# Altium schematic sheet MCU_STM32L011.SchDoc: MCU_STM32L011
size A4; DrawnBy: BossFish; Revision: Test/v0.2; SheetNumber: 3; SheetTotal: 4
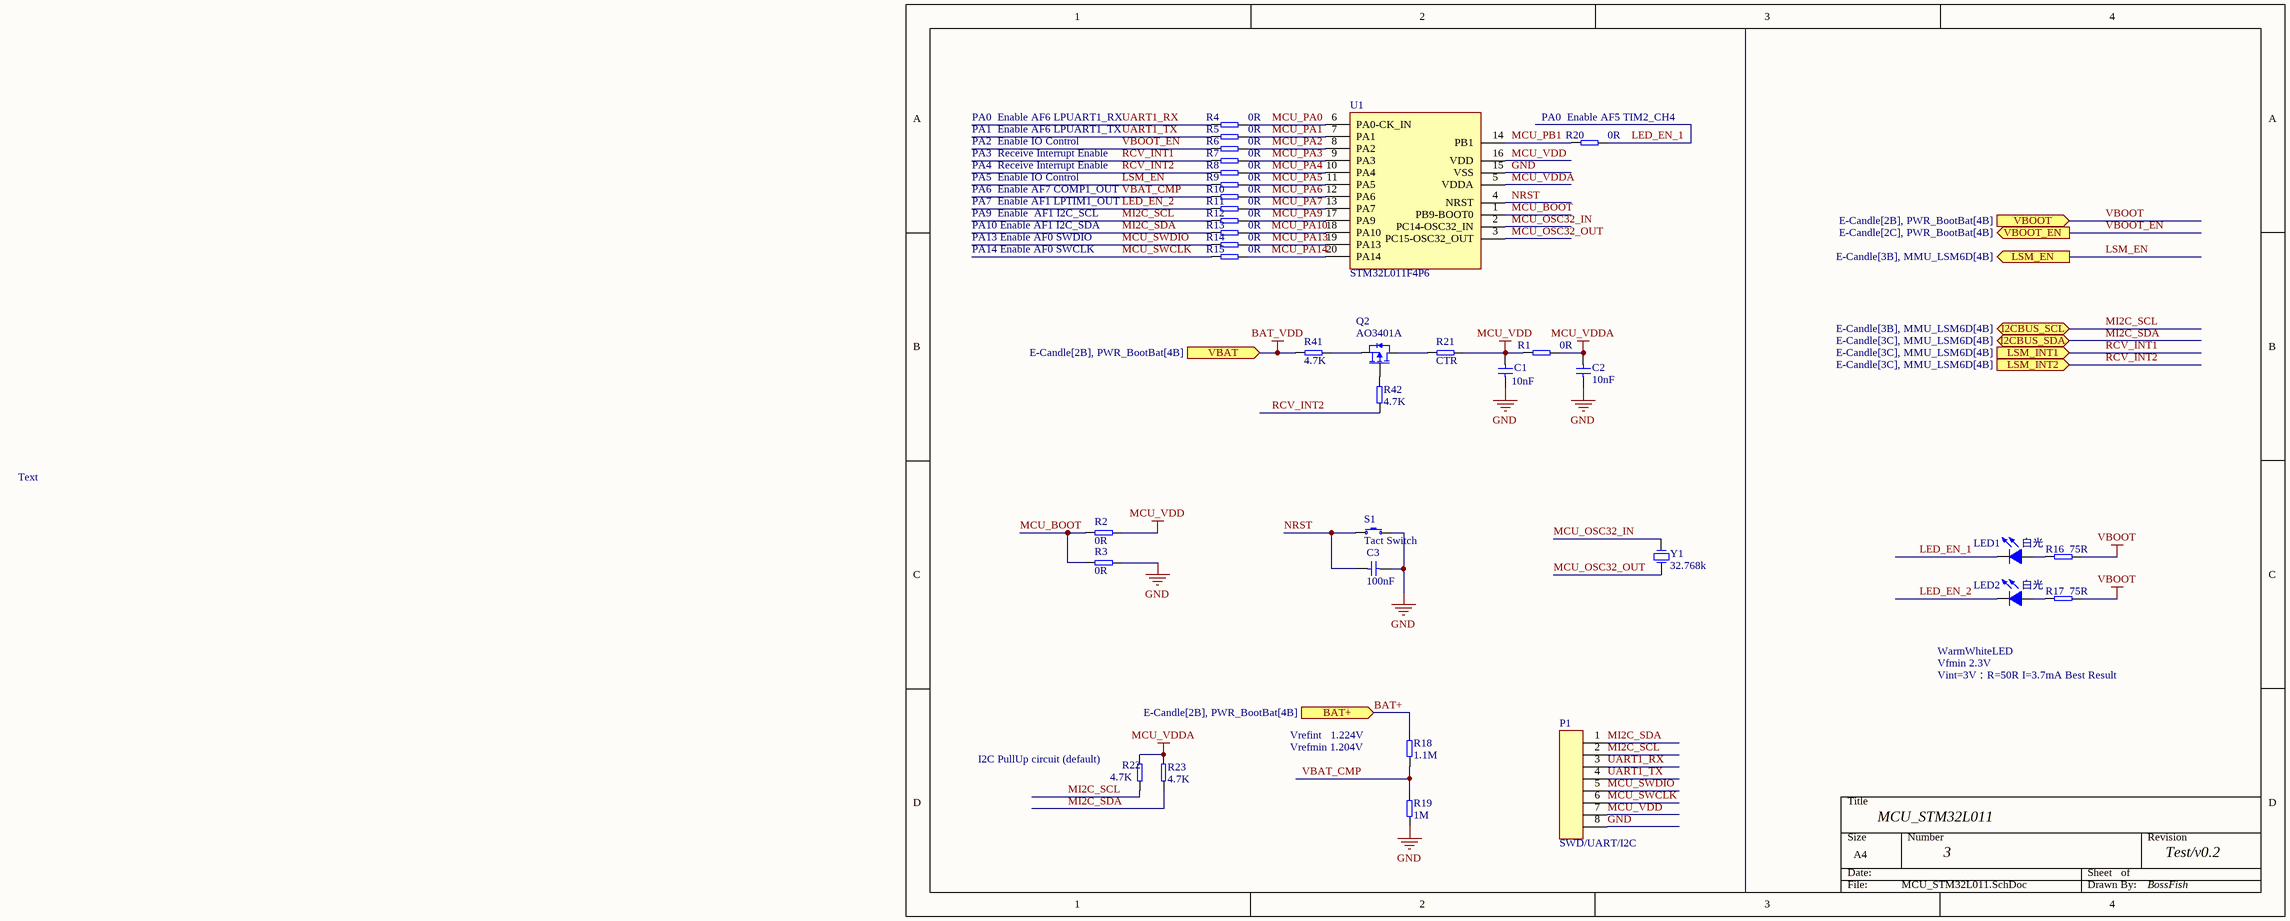
[diagram p0: MCU_STM32L011.SchDoc]

## Parts
C1  10nF  [0603-C]
C2  10nF  [0603-C]
C3  100nF  [0603-C]
LED1  白光  [0805-LED]
LED2  白光  [0805-LED]
P1  SWD/UART/I2C  [2.54mm 1x8P]
Q2  AO3401A  [SOT-23-3]
R1  0R  [0603-R]
R2  0R  [0603-R]
R3  0R  [0603-R]
R4  0R  [0603-R]
R5  0R  [0603-R]
R6  0R  [0603-R]
R7  0R  [0603-R]
R8  0R  [0603-R]
R9  0R  [0603-R]
R10  0R  [0603-R]
R11  0R  [0603-R]
R12  0R  [0603-R]
R13  0R  [0603-R]
R14  0R  [0603-R]
R15  0R  [0603-R]
R16  75R  [0603-R]
R17  75R  [0603-R]
R18  1.1M  [0603-R]
R19  1M  [0603-R]
R20  0R  [0603-R]
R21  CTR  [0603-R]
R22  4.7K  [0603-R]
R23  4.7K  [0603-R]
R41  4.7K  [0603-R]
R42  4.7K  [0603-R]
S1  Tact Switch  [TS-3025]
U1  STM32L011F4P6  [TSSOP-20]
Y1  32.768k  [SMD3215-2P]

## Ports
BAT+ (in, see E-Candle[2B], PWR_BootBat[4B]), I2CBUS_SCL (bidir, see E-Candle[3B], MMU_LSM6D[4B]), I2CBUS_SDA (bidir, see E-Candle[3C], MMU_LSM6D[4B]), LSM_EN (out, see E-Candle[3B], MMU_LSM6D[4B]), LSM_INT1 (in, see E-Candle[3C], MMU_LSM6D[4B]), LSM_INT2 (in, see E-Candle[3C], MMU_LSM6D[4B]), VBAT (in, see E-Candle[2B], PWR_BootBat[4B]), VBOOT (in, see E-Candle[2B], PWR_BootBat[4B]), VBOOT_EN (out, see E-Candle[2C], PWR_BootBat[4B])

## Nets
BAT_VDD: R41.2 ; port VBAT
GND: C1.1 C2.1 C3.2 P1.8 R3.1 R19.1 S1.2 U1.15(VSS)
MCU_VDD: C1.2 P1.7 R1.2 R2.1 R21.1 U1.16(VDD)
MCU_VDDA: C2.2 R1.1 R22.2 R23.2 U1.5(VDDA)
VBOOT: R16.2 R17.2 ; port VBOOT
BAT+: R18.2 ; port BAT+
LED_EN_1: LED1.1 R20.1
LED_EN_2: LED2.1 R11.2
LSM_EN: R9.2 ; port LSM_EN
MCU_BOOT: R2.2 R3.2 U1.1(PB9-BOOT0)
MCU_OSC32_IN: U1.2(PC14-OSC32_IN) Y1.2
MCU_OSC32_OUT: U1.3(PC15-OSC32_OUT) Y1.1
MCU_PA0: R4.1 U1.6(PA0-CK_IN)
MCU_PA1: R5.1 U1.7(PA1)
MCU_PA2: R6.1 U1.8(PA2)
MCU_PA3: R7.1 U1.9(PA3)
MCU_PA4: R8.1 U1.10(PA4)
MCU_PA5: R9.1 U1.11(PA5)
MCU_PA6: R10.1 U1.12(PA6)
MCU_PA7: R11.1 U1.13(PA7)
MCU_PA9: R12.1 U1.17(PA9)
MCU_PA10: R13.1 U1.18(PA10)
MCU_PA13: R14.1 U1.19(PA13)
MCU_PA14: R15.1 U1.20(PA14)
MCU_PB1: R20.2 U1.14(PB1)
MCU_SWCLK: P1.6 R15.2
MCU_SWDIO: P1.5 R14.2
MI2C_SCL: P1.2 R12.2 R22.1 ; port I2CBUS_SCL
MI2C_SDA: P1.1 R13.2 R23.1 ; port I2CBUS_SDA
NRST: C3.1 S1.1 U1.4(NRST)
RCV_INT1: R7.2 ; port LSM_INT1
RCV_INT2: R8.2 R42.2 ; port LSM_INT2
UART1_RX: P1.3 R4.2
UART1_TX: P1.4 R5.2
VBAT_CMP: R10.2 R18.1 R19.2
VBOOT_EN: R6.2 ; port VBOOT_EN
NetLED1_2: LED1.2 R16.1
NetLED2_2: LED2.2 R17.1
NetQ2_1: Q2.1(D) R21.2
NetQ2_2: Q2.2(G) R42.1
NetQ2_3: Q2.3(S) R41.1

## Notes on the sheet
- PA0  Enable AF6 LPUART1_RX
- PA1  Enable AF6 LPUART1_TX
- PA2  Enable IO Control
- PA3  Receive Interrupt Enable
- (near R20) PA0  Enable AF5 TIM2_CH4
- PA9  Enable  AF1 I2C_SCL
- PA6  Enable AF7 COMP1_OUT
- PA7  Enable AF1 LPTIM1_OUT
- PA5  Enable IO Control
- PA4  Receive Interrupt Enable
- PA10 Enable AF1 I2C_SDA
- PA13 Enable AF0 SWDIO
- PA14 Enable AF0 SWCLK
- Text
- WarmWhiteLED
- Vfmin 2.3V
- Vint=3V：R=50R I=3.7mA Best Result
- (near R18) Vrefint   1.224V
- Vrefmin 1.204V
- (near R22) I2C PullUp circuit (default)

## Library data of the parts
C1-C3 = Cap
LED1 LED2 = LED
P1 = Header 1x8P
Q2 = MOSFET-P
R1-R23 R41 R42 = Res
U1 = STM32L011F4P6: Ultra-low-power 32-bit MCU Arm®-based / Cortex®-M0+, 16KB Flash, 2KB SRAM, 512B EEPROM, ADC/TSSOP-20
Y1 = XTAL